# EasyEDA schematic SCH_LucesLectura_2023-04-08.json
TITLE: Luces de Lectura; REV: 7.0; Date: 12 Marzo 2023; Sheet: 1/1; Drawn By: Aurelio G.; Company: Aurelio G.
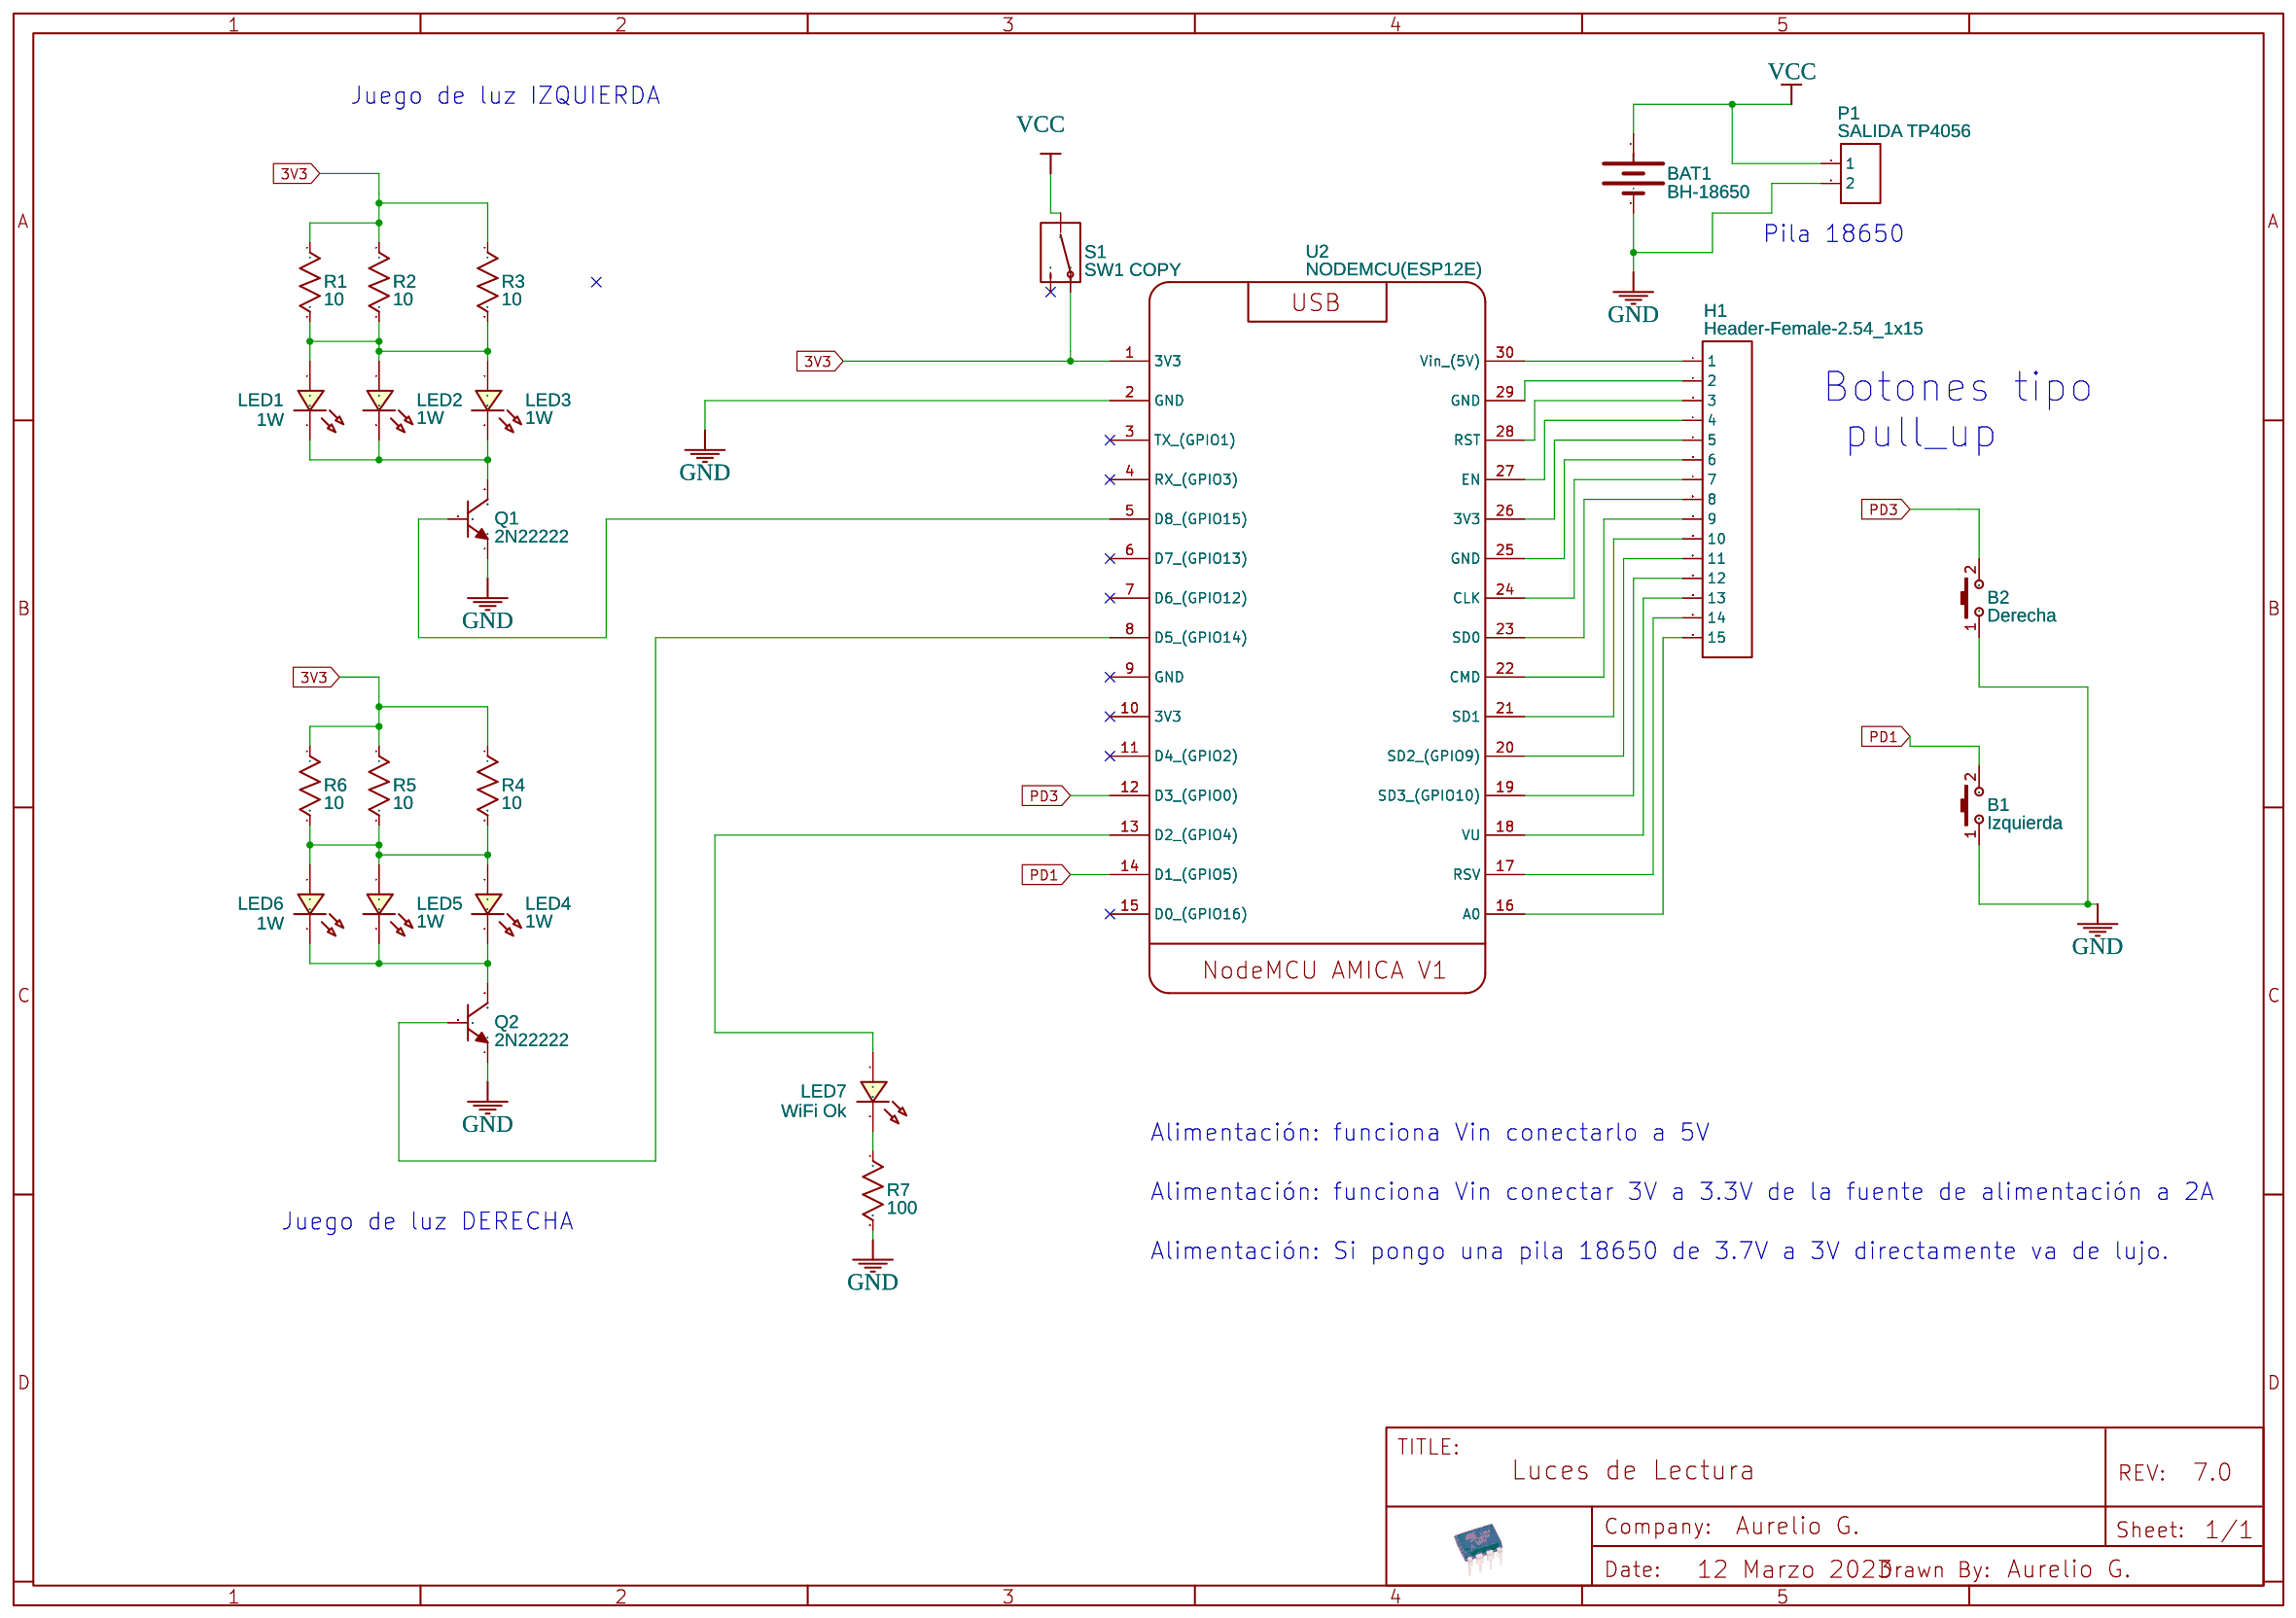
[diagram p0: schematic sheet]

## Parts
B1  Izquierda  [DOS PINES SOLDADURA]
B2  Derecha  [DOS PINES SOLDADURA]
BAT1  BH-18650  [BAT-TH_18650]
H1  Header-Female-2.54_1x15  [HDR-TH_15P-P2.54-V-F-1]
LED1  1W  [LED_D5.0MM_FLATTOP]
LED2  1W  [LED_D5.0MM_FLATTOP]
LED3  1W  [LED_D5.0MM_FLATTOP]
LED4  1W  [LED_D5.0MM_FLATTOP]
LED5  1W  [LED_D5.0MM_FLATTOP]
LED6  1W  [LED_D5.0MM_FLATTOP]
LED7  WiFi Ok  [LED_D3.0MM_FLATTOP]
P1  SALIDA TP4056  [CONN-TH_2P-P5.00]
Q1  2N22222  [TO-92]
Q2  2N22222  [TO-92]
R1  10  [AXIAL-6.3X2.4]
R2  10  [AXIAL-6.3X2.4]
R3  10  [AXIAL-6.3X2.4]
R4  10  [AXIAL-6.3X2.4]
R5  10  [AXIAL-6.3X2.4]
R6  10  [AXIAL-6.3X2.4]
R7  100  [AXIAL-6.3X2.4]
S1  SW1 COPY  [KEY-TH_100GMICROSWITCH]
U2  NODEMCU(ESP12E)  [NODEMCU_AMICA_V1]

## Library data of the parts
B1 B2 = push_button_2pins: Manufacturer Part: PUSH_BUTTON_2Pini; Contributor: Hiccup 20
BAT1 = BH-18650: Supplier: LCSC; Supplier Part: C9900017971; Manufacturer: null; Contributor: lcsc; JLCPCB Part Class: Extended Part; Package Display: No
H1 = Header-Female-2.54_1x15: Supplier: LCSC; Manufacturer: Ckmtw(灿科盟); Manufacturer Part: B-2200S15P-A120; Supplier Part: C124408; JLCPCB Part Class: Extended Part
LED1-LED7 = LED-0603_R: Manufacturer: EVERLIGHT(台湾亿光); Manufacturer Part: 19-217/R6C-AL1M2VY/3T; Supplier Part: C72044; Supplier: LCSC; Contributor: LCEDA_01
P1 = CONN-TH_2P-P5.00: Supplier: LCSC; Contributor: LCEDA_Lib
Q1 Q2 = Transistor.2N22222.NPN: Supplier: LCSC; Manufacturer: SEMTECH; Manufacturer Part: 2N3904; Supplier Part: C118538; Contributor: smugeelan
R1 R3 = R_0603_US: Contributor: LCEDA_Lib; Package Display: No
R2 R4-R7 = R_0603_US: Contributor: LCEDA_Lib
S1 = SW1 COPY: Contributor: Raul Hejja
U2 = NODEMCU(ESP12E): Contributor: pritams07; Author: Krzysztof Daszuta; sourceId: c4ASM4mEW; Supplier Part: nodemcu-v2; Supplier: Nettigo

## Nets
3V3: R1.1 R2.1 R3.1 R4.1 R5.1 R6.1 S1.1(O) U2.1(3V3)
GND: B1.1 B2.1 BAT1.2(+) P1.2 Q1.1(E) Q2.1(E) R7.2 U2.2(GND)
VCC: BAT1.1(-) P1.1 S1.2(P)
PD1: B1.2 U2.14(D1 (GPIO5))
PD3: B2.2 U2.12(D3 (GPIO0))
Net-(H1-1): H1.1 U2.30(Vin (5V))
Net-(H1-2): H1.2 U2.29(GND)
Net-(H1-3): H1.3 U2.28(RST)
Net-(H1-4): H1.4 U2.27(EN)
Net-(H1-5): H1.5 U2.26(3V3)
Net-(H1-6): H1.6 U2.25(GND)
Net-(H1-7): H1.7 U2.24(CLK)
Net-(H1-8): H1.8 U2.23(SD0)
Net-(H1-9): H1.9 U2.22(CMD)
Net-(H1-10): H1.10 U2.21(SD1)
Net-(H1-11): H1.11 U2.20(SD2 (GPIO9))
Net-(H1-12): H1.12 U2.19(SD3 (GPIO10))
Net-(H1-13): H1.13 U2.18(VU)
Net-(H1-14): H1.14 U2.17(RSV)
Net-(H1-15): H1.15 U2.16(A0)
Net-(LED1-1): LED1.1 LED2.1 LED3.1 R1.2 R2.2 R3.2
Net-(LED1-2): LED1.2 LED2.2 LED3.2 Q1.3(C)
Net-(LED4-1): LED4.1 LED5.1 LED6.1 R4.2 R5.2 R6.2
Net-(LED4-2): LED4.2 LED5.2 LED6.2 Q2.3(C)
Net-(LED7-1): LED7.1 U2.13(D2 (GPIO4))
Net-(LED7-2): LED7.2 R7.1
Net-(Q1-2): Q1.2(B) U2.5(D8 (GPIO15))
Net-(Q2-2): Q2.2(B) U2.8(D5 (GPIO14))

Not connected (* = marked no-connect by the designer): S1 3(S)*; U2 3(TX (GPIO1))* 4(RX (GPIO3))* 6(D7 (GPIO13))* 7(D6 (GPIO12))* 9(GND)* 10(3V3)* 11(D4 (GPIO2))* 15(D0 (GPIO16))*

## Notes on the sheet
- Juego de luz IZQUIERDA
- Pila 18650
- Botones tipo
   pull_up
- Alimentación: funciona Vin conectarlo a 5V
- Alimentación: funciona Vin conectar 3V a 3.3V de la fuente de alimentación a 2A
- Juego de luz DERECHA
- Alimentación: Si pongo una pila 18650 de 3.7V a 3V directamente va de lujo.
